# EAGLE schematic stir_plate (EAGLE 7.6.0)
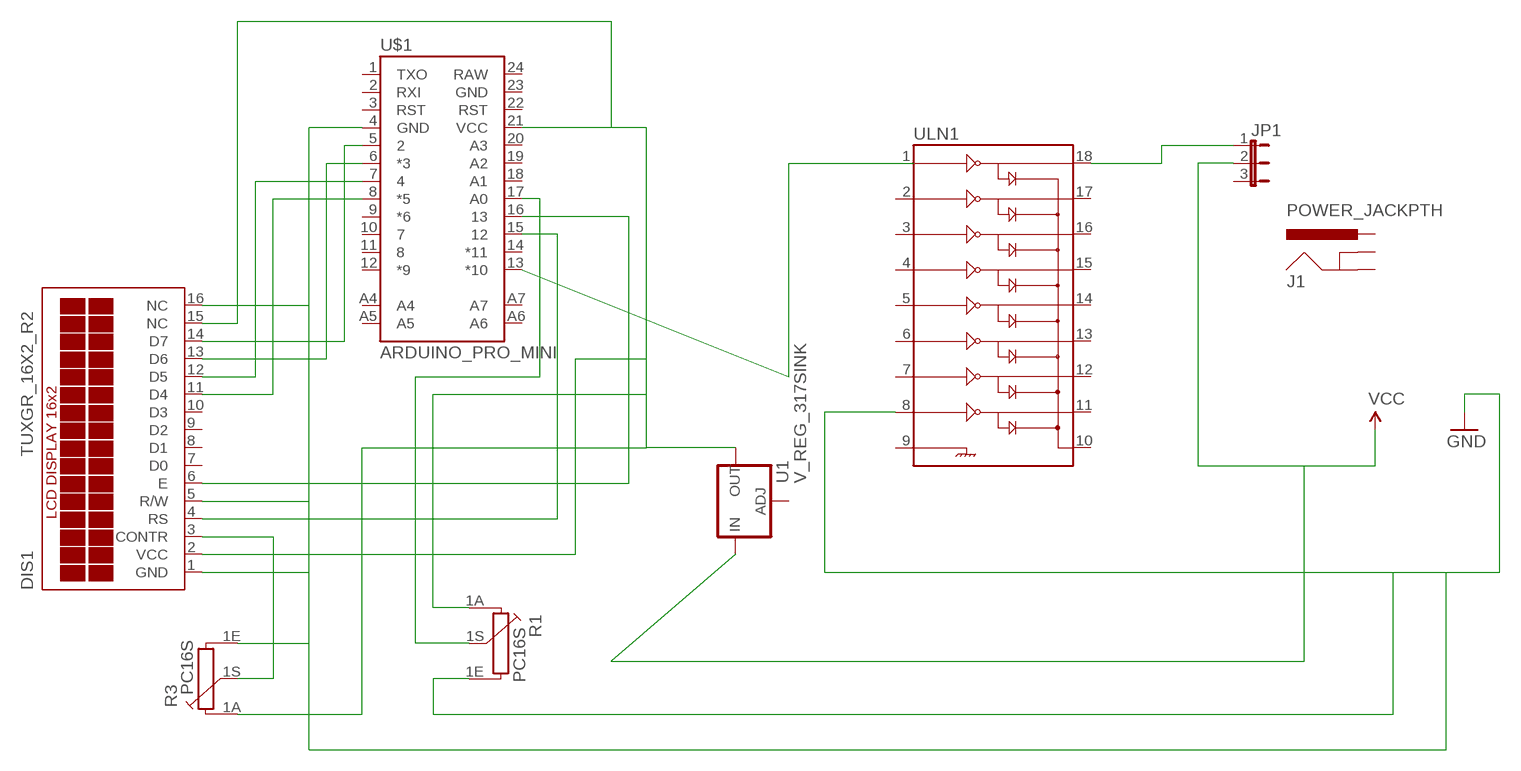
[diagram p0: schematic, sheet 1]

## Parts
DIS1  TUXGR_16X2_R2  [TUXGR_16X2_R2]
J1  POWER_JACKPTH  [POWER_JACK_PTH]
JP1  JP2E  [JP2]
R1  PC16S  [PC16S]
R3  PC16S  [PC16S]
U1  V_REG_317SINK  [TO220-ADJ]
U$1  ARDUINO_PRO_MINI  [ARDUINO_PRO_MINI]
ULN1  ULN2803DIP  [DIL18]

## Nets
GND: DIS1.1(GND) DIS1.5(R/W) DIS1.16(NC) R1.1E R3.1E U$1.4(GND) ULN1.8
N$1: U$1.13(*10)
N$2: JP1.1 ULN1.18
N$3: DIS1.3(CONTR) R3.1S
N$4: DIS1.11(D4) U$1.8(*5)
N$7: DIS1.12(D5) U$1.7
N$8: DIS1.2(VCC) DIS1.15(NC) R1.1A R3.1A U1.OUT U$1.21(VCC)
N$9: DIS1.13(D6) U$1.6(*3)
N$10: DIS1.14(D7) U$1.5
N$11: DIS1.4(RS) U$1.15
N$12: R1.1S U$1.17(A0)
N$13: DIS1.6(E) U$1.16
VCC: JP1.2 U1.IN
Unconnected: DIS1.7(D0) DIS1.8(D1) DIS1.9(D2) DIS1.10(D3) J1.GND J1.GNDBREAK J1.PWR JP1.3 U1.ADJ U$1.1(TXO) U$1.2(RXI) U$1.3(RST) U$1.9(*6) U$1.10 U$1.11 U$1.12(*9) U$1.14(*11) U$1.18(A1) U$1.19(A2) U$1.20(A3) U$1.22(RST) U$1.23(GND) U$1.24(RAW) U$1.A4 U$1.A5 U$1.A6 U$1.A7 ULN1.1 ULN1.2 ULN1.3 ULN1.4 ULN1.5 ULN1.6 ULN1.7 ULN1.9 ULN1.10 ULN1.11 ULN1.12 ULN1.13 ULN1.14 ULN1.15 ULN1.16 ULN1.17

## Library data of the parts
DIS1 = display-lcd:TUXGR_16X2_R2: Tuxgraphics LCD display 16x2 characters reflective, without background light Source: tuxgr_12x2_r2.pdf; OC_FARNELL: unknown; OC_NEWARK: unknown
J1 = SparkFun-Connectors:POWER_JACK: Power Jack This is the standard 5.5mm barrel jack for power. The PTH is the most common, proven, reliable, footprint. The Slot footprint only works if the mill layer is transmitted to the PCB fab house so be warned. Mating wall wart : TOL-00298 (and others); PROD_ID: CONN-08197
JP1 = jumper:JP2E: JUMPER
R1 R3 = piher:PC16S: POTENTIOMETER single carbon potentiometer, 16 mm, S3ROH; OC_FARNELL: 4452940; OC_NEWARK: unknown
U1 = SparkFun-PowerIC:V_REG_317: Voltage Regulator Standard LM317 adjustable voltage regulator. AOI (Adjust Output Input). Google 'LM317 Calculator' for easy to use app to get the two resistor values needed. 240/720 for 5V output. 240/390 for 3.3V output. Spark Fun Electronics SKU : COM-00527
U$1 = SparkFun-Boards:ARDUINO_PRO_MINI
ULN1 = SparkFun-PowerIC:ULN2803: Darlington Driver ULN2803 Darlington array. 500mA max per channel, 8-channel package. Spark Fun Electronics SKU : COM-00312

## Net classes
0 default: clearance 0.205 mm